# Altium schematic sheet CAN_XCVR_3.3V.SchDoc
size A
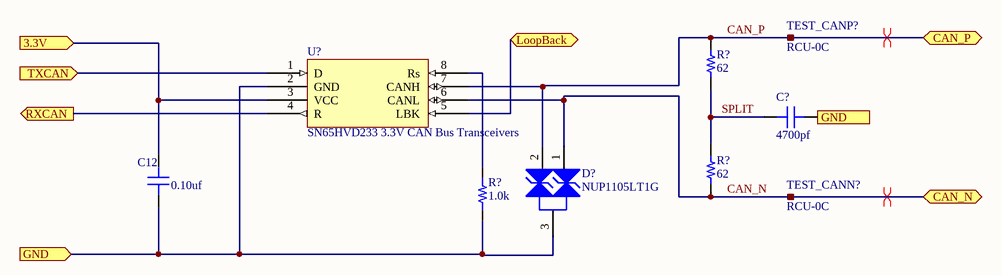
[diagram p0: CAN_XCVR_3.3V.SchDoc]

## Parts
(Parts that share a designator on the sheet are numbered #1, #2 ... from top to bottom, then left to right.)
C12  value 0.10uf  [CAP 0603/1608]  (hidden comment: Capacitor MLCC 0.10uf 50V CAP 0603/1608)
C?  value 4700pf  [CAP 0603/1608]  (hidden comment: Capacitor MLCC 4700pf 50V CAP 0603/1608)
D?  NUP1105LT1G  [SOT-23 (TO-236)]
R?#1  value 62  [RES 0603/1608]  (hidden comment: Resistor 62 0603 1/10W 5%)
R?#2  value 62  [RES 0603/1608]  (hidden comment: Resistor 62 0603 1/10W 5%)
R?#3  value 1.0k  [RES 0603/1608]  (hidden comment: Resistor 1.0k 0603 1/10W 1%)
TEST_CANN?  RCU-0C  [RCU-0C]
TEST_CANP?  RCU-0C  [RCU-0C]
U?  SN65HVD233 3.3V CAN Bus Transceivers  [SOIC-8]

## Ports
3.3V (in), CAN_N (bidir), CAN_P (bidir), GND (in), LoopBack (bidir), RXCAN (out), TXCAN (in)

## Nets
3.3V: C12.1 U?.3(VCC) ; port 3.3V
CAN_N: D?.1(K) R?#2.2 TEST_CANN?.1 U?.6(CANL) ; port CAN_N
CAN_P: D?.2(K) R?#1.1 TEST_CANP?.1 U?.7(CANH) ; port CAN_P
GND: C12.2 C?.1 D?.3(K) R?#3.1 U?.2(GND) ; port GND
LoopBack: U?.5(LBK) ; port LoopBack
RXCAN: U?.4(R) ; port RXCAN
SPLIT: C?.2 R?#1.2 R?#2.1
TXCAN: U?.1(D) ; port TXCAN
NetR?#3_2: R?#3.2 U?.8(Rs)

## Layout directives
differential pair: CAN_N, CAN_P

## Library data of the parts
C12 = 943: Manufacturer_id: 1; idCapacitor: 943; Name: Cap_0.10uf_50V_CAP 0603/1608; Dielectric: Ceramic; Created_By: Nick Mah; Drawer_id: 1; Voltage_Rating: 50V; Package: CAP 0603/1608; Created_Date: 10/20/2018
C? = 929: Manufacturer_id: 1; idCapacitor: 929; Name: Cap_4700pf_50V_CAP 0603/1608; Dielectric: Ceramic; Created_By: Nick Mah; Drawer_id: 1; Voltage_Rating: 50V; Package: CAP 0603/1608; Created_Date: 10/20/2018
D? = 7: ESD Protection Diode; Manufacturer_id: 1; idDiode: 7; Name: SOT-23_350W_Zener; Value: TVS_24V; Type: Zener; Ic: 8A; Power: 350W; Drawer_id: 1; Num_Circuits: 1; Package: SOT-23; MfrPartNo: NUP1105LT1G; Link: https://www.digikey.com/product-detail/en/on-semiconductor/NUP1105LT1G/NUP1105LT1GOSCT-ND/2122067; ComponentLink1URL: https://www.digikey.com/product-detail/en/on-semiconductor/NUP1105LT1G/NUP1105LT1GOSCT-ND/2122067; Supplier1: Digikey; Supplier1PartNo: NUP1105LT1GOSCT-ND
R?#1 R?#2 = 1340: Manufacturer_id: 1; idResistor: 1340; Name: Res_62_0603_1/10W_5%; Created_By: Nick Mah; Supplier 1: Digi-Key; Drawer_id: 1; Tolerance: 5%; Power: 1/10W; Package: 0603; ComponentLink1Description: Datasheet; Created_Date: 2018-10-20
R?#3 = 289: Manufacturer_id: 1; idResistor: 289; Name: Res_1.0k_0603_1/10W_1%; Created_By: Nick Mah; Supplier 1: Digi-Key; Drawer_id: 1; Tolerance: 1%; Power: 1/10W; Package: 0603; ComponentLink1Description: Datasheet; Created_Date: 2018-10-20
TEST_CANN? TEST_CANP? = 5: Manufacturer_id: 1; idTable: 5; Name: RCU-0C_Test_Point; Drawer_id: 1; Package: 0603; MfrPartNo: RCU-0C; Link: https://www.digikey.com/product-detail/en/te-connectivity-amp-connectors/RCU-0C/A106145CT-ND/3477802; ComponentLink1Description: Datasheet; ComponentLink1URL: https://www.te.com/commerce/DocumentDelivery/DDEController?Action=srchrtrv&DocNm=1773266&DocType=DS&DocLang=English
U? = 9: 1/1 Transceiver Half CANbus 8-SOIC; Manufacturer_id: 1; MfrPartNo: SN65HVD233D; idIC_Interface: 9; Name: CAN Transceiver; Value: CAN to UART; Data_Rate: 1Mbps; Vin(Min): 3V; Vin(Max): 3.6V; Drawer_id: 1; Type: Transceiver; Protocol: CAN; Num_Circuits: 1; Package: SOIC-8; Link: https://www.digikey.com/products/en?mpart=SN65HVD233D&v=296; Supplier1: digikey; Supplier1PartNo: 296-14639-5-ND